# EAGLE design digimax-universal (EAGLE 4.13)
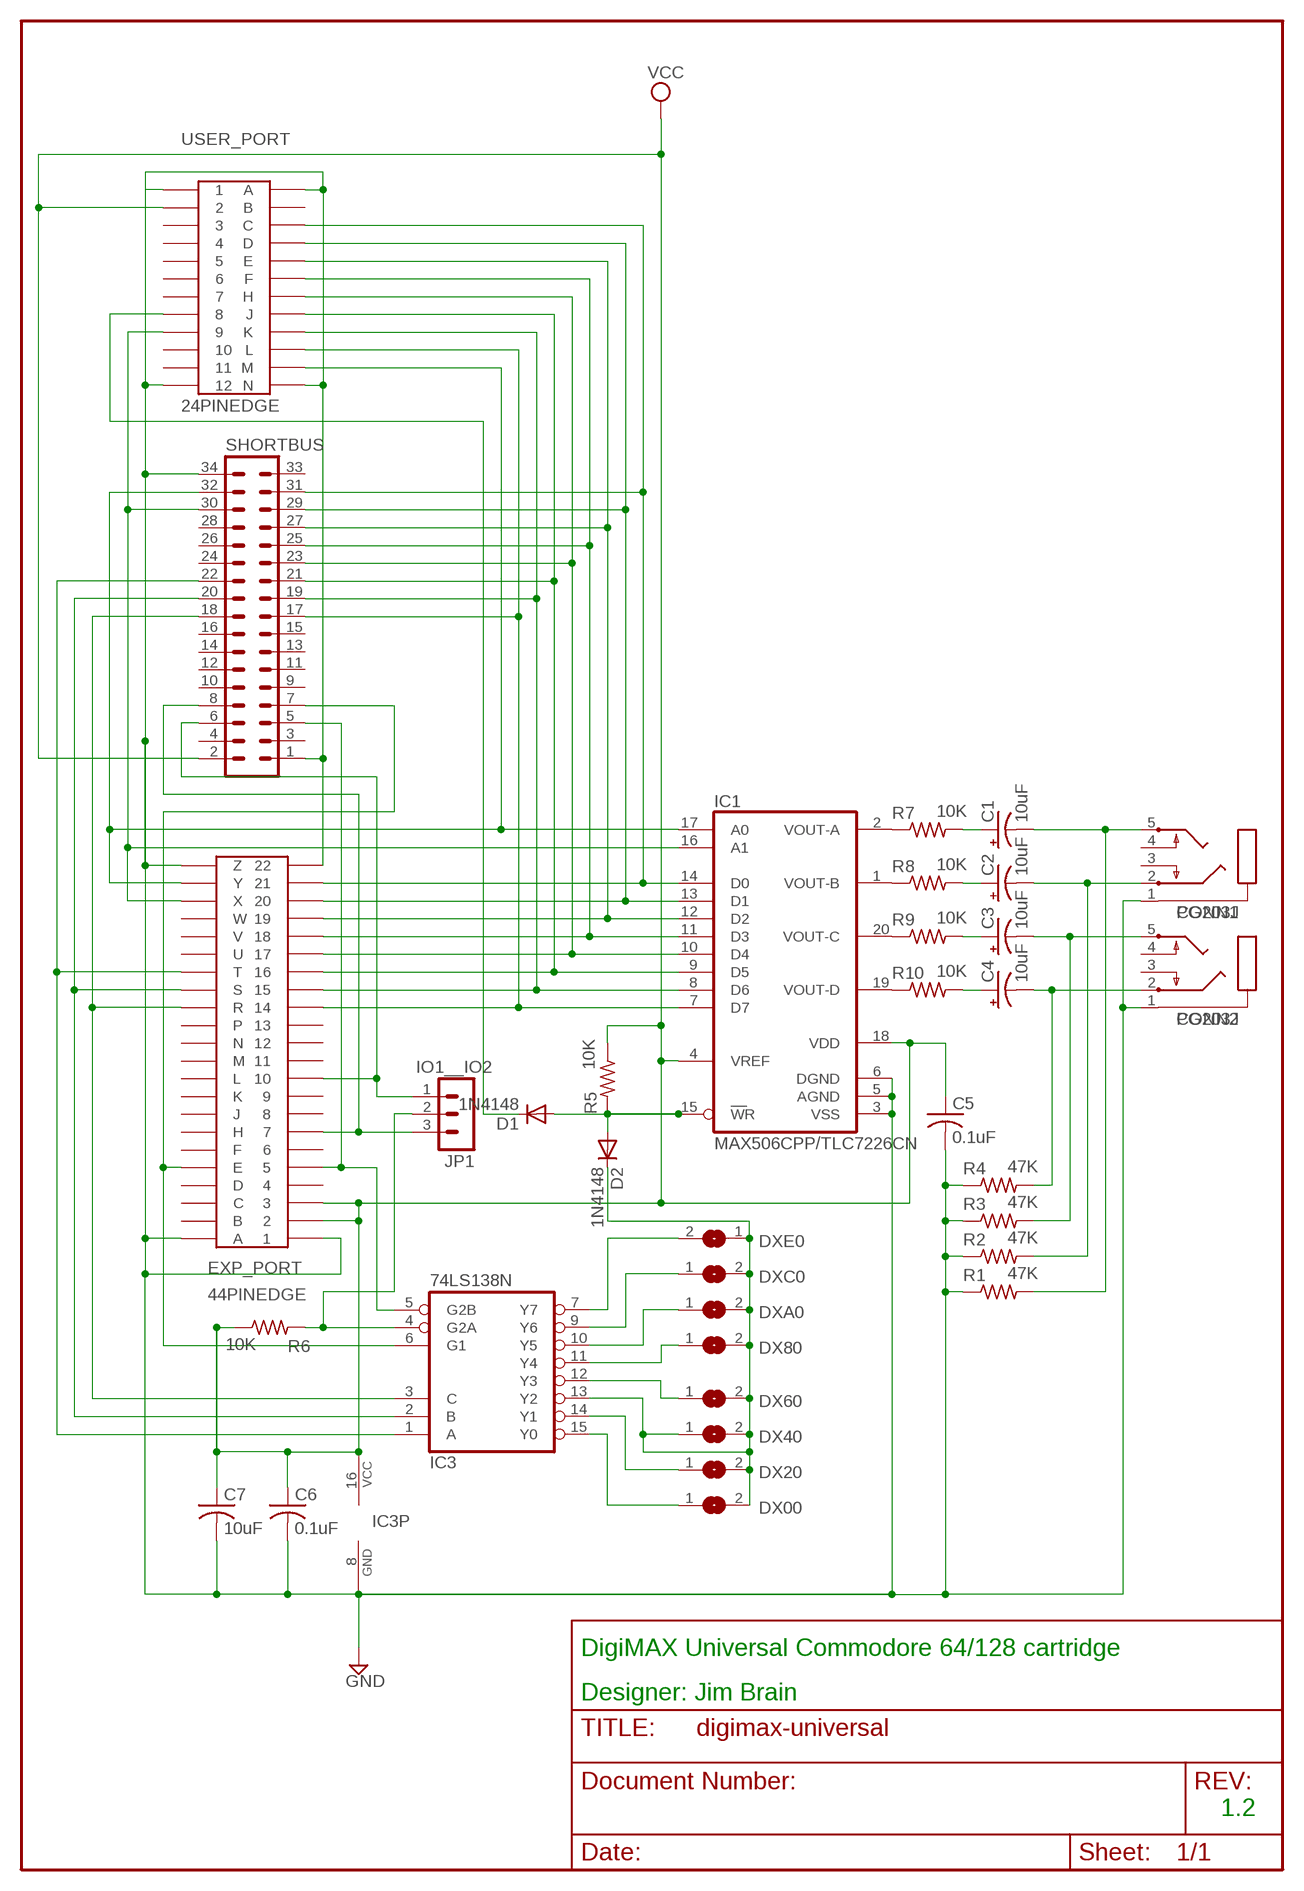
[diagram p0: schematic, sheet 1]

## Parts
C1  10uF  CPOL-USE2-5  [E2-5]
C2  10uF  CPOL-USE2-5  [E2-5]
C3  10uF  CPOL-USE2-5  [E2-5]
C4  10uF  CPOL-USE2-5  [E2-5]
C5  0.1uF  C-US025-024X044  [C025-024X044]
C6  0.1uF  C-US025-024X044  [C025-024X044]
C7  10uF  C-US025-025X050  [C025-025X050]
CONN1  PG203J  [PG203J]
CONN2  PG203J  [PG203J]
D1  1N4148  DIODE-D-2.5  [D-2.5]
D2  1N4148  DIODE-D-2.5  [D-2.5]
DX00  SJ  [SJ]
DX20  SJ  [SJ]
DX40  SJ  [SJ]
DX60  SJ  [SJ]
DX80  SJ  [SJ]
DXA0  SJ  [SJ]
DXC0  SJ  [SJ]
DXE0  SJ  [SJ]
EXP_PORT  44PINEDGE  [44PINEDGE]
IC1  MAX506CPP/TLC7226CN  MAX506CPP  [DIL20]
IC3  74LS138N  [DIL16]
JP1  IO1__IO2  MA03-1  [MA03-1]
R1  47K  R-US_0207/2V  [0207/2V]
R2  47K  R-US_0207/2V  [0207/2V]
R3  47K  R-US_0207/2V  [0207/2V]
R4  47K  R-US_0207/2V  [0207/2V]
R5  10K  R-US_0204/7  [0204/7]
R6  10K  R-US_0207/2V  [0207/2V]
R7  10K  R-US_0207/2V  [0207/2V]
R8  10K  R-US_0207/2V  [0207/2V]
R9  10K  R-US_0207/2V  [0207/2V]
R10  10K  R-US_0207/2V  [0207/2V]
SHORTBUS  MA17-2  [MA17-2]
USER_PORT  24PINEDGE  [24PINEDGE]

## Nets
GND: C5.2 C6.2 C7.2 CONN1.1 CONN2.1 EXP_PORT.1 EXP_PORT.22 EXP_PORT.A EXP_PORT.Z IC1.3(VSS) IC1.5(AGND) IC1.6(DGND) IC3.8(GND) R1.1 R2.1 R3.1 R4.1 SHORTBUS.1 SHORTBUS.34 USER_PORT.1 USER_PORT.12 USER_PORT.A USER_PORT.N
N$1: EXP_PORT.21 IC1.14(D0) SHORTBUS.31 USER_PORT.C
N$2: EXP_PORT.20 IC1.13(D1) SHORTBUS.29 USER_PORT.D
N$3: EXP_PORT.19 IC1.12(D2) SHORTBUS.27 USER_PORT.E
N$4: EXP_PORT.18 IC1.11(D3) SHORTBUS.25 USER_PORT.F
N$5: EXP_PORT.17 IC1.10(D4) SHORTBUS.23 USER_PORT.H
N$6: EXP_PORT.16 IC1.9(D5) SHORTBUS.21 USER_PORT.J
N$7: EXP_PORT.15 IC1.8(D6) SHORTBUS.19 USER_PORT.K
N$8: EXP_PORT.14 IC1.7(D7) SHORTBUS.17 USER_PORT.L
N$9: EXP_PORT.Y IC1.17(A0) SHORTBUS.32 USER_PORT.M
N$10: DXE0.2 IC3.7(Y7)
N$11: EXP_PORT.X IC1.16(A1) SHORTBUS.30 USER_PORT.9
N$12: EXP_PORT.10 JP1.1 SHORTBUS.6
N$13: D1.C USER_PORT.8
N$15: EXP_PORT.T IC3.1(A) SHORTBUS.22
N$16: IC3.4(G2A) JP1.2 R6.2
N$17: C1.+ R7.2
N$18: C2.+ R8.2
N$19: C3.+ R9.2
N$20: C4.+ R10.2
N$21: C4.- CONN2.2 R4.2
N$22: C3.- CONN2.5 R3.2
N$23: C2.- CONN1.2 R2.2
N$24: C1.- CONN1.5 R1.2
N$25: EXP_PORT.S IC3.2(B) SHORTBUS.20
N$26: EXP_PORT.R IC3.3(C) SHORTBUS.18
N$27: DXC0.1 IC3.9(Y6)
N$28: EXP_PORT.5 IC3.5(G2B) SHORTBUS.5
N$29: DXA0.1 IC3.10(Y5)
N$30: DX80.1 IC3.11(Y4)
N$31: DX60.1 IC3.12(Y3)
N$32: D2.C DX00.2 DX20.2 DX40.1 DX40.2 DX60.2 DX80.2 DXA0.2 DXC0.2 DXE0.1 IC3.13(Y2)
N$33: DX20.1 IC3.14(Y1)
N$34: DX00.1 IC3.15(Y0)
N$36: IC1.2(VOUT-A) R7.1
N$37: IC1.1(VOUT-B) R8.1
N$38: IC1.20(VOUT-C) R9.1
N$39: IC1.19(VOUT-D) R10.1
N$40: EXP_PORT.E IC3.6(G1) SHORTBUS.7
N$41: D1.A D2.A IC1.15(WR) R5.2
N$43: EXP_PORT.7 JP1.3 SHORTBUS.8
VCC: C5.1 C6.1 C7.1 EXP_PORT.2 EXP_PORT.3 IC1.4(VREF) IC1.18(VDD) IC3.16(VCC) R5.1 R6.1 SHORTBUS.2 USER_PORT.2
Unconnected: CONN1.3 CONN1.4 CONN2.3 CONN2.4 EXP_PORT.4 EXP_PORT.6 EXP_PORT.8 EXP_PORT.9 EXP_PORT.11 EXP_PORT.12 EXP_PORT.13 EXP_PORT.B EXP_PORT.C EXP_PORT.D EXP_PORT.F EXP_PORT.H EXP_PORT.J EXP_PORT.K EXP_PORT.L EXP_PORT.M EXP_PORT.N EXP_PORT.P EXP_PORT.U EXP_PORT.V EXP_PORT.W SHORTBUS.3 SHORTBUS.4 SHORTBUS.9 SHORTBUS.10 SHORTBUS.11 SHORTBUS.12 SHORTBUS.13 SHORTBUS.14 SHORTBUS.15 SHORTBUS.16 SHORTBUS.24 SHORTBUS.26 SHORTBUS.28 SHORTBUS.33 USER_PORT.3 USER_PORT.4 USER_PORT.5 USER_PORT.6 USER_PORT.7 USER_PORT.10 USER_PORT.11 USER_PORT.B

## Notes on the sheet
- DigiMAX Universal Commodore 64/128 cartridge
- Designer: Jim Brain
- 1.2

## Library data of the parts
C1-C4 = rcl:CPOL-US: POLARIZED CAPACITOR, American symbol
C5-C7 = rcl:C-US: CAPACITOR, American symbol
CONN1 CONN2 = con-hirschmann:PG203J: MIC/HEADPHONE JACK KS-S stereo microphone/headphone jack PG203JN (Schukat)
D1 D2 = diode:DIODE-: DIODE
DX00 DX20 DX40 DX60 DX80 DXA0 DXC0 DXE0 = jumper:SJ: SMD solder JUMPER
EXP_PORT = edge-100:44PINEDGE: 44 PIN EDGE CONNECTOR FOR PCB
IC1 = maxim:MAX506CPP: DIGITAL/ANALOG CONVERTER
IC3 = 74xx-us:74*138: 3-line to 8-line DECODER/DEMULTIPLEXER
JP1 = con-lstb:MA03-1: PIN HEADER
R1-R10 = rcl:R-US_: RESISTOR, American symbol
SHORTBUS = con-lstb:MA17-2: PIN HEADER
USER_PORT = edge-156:24PINEDGE

## Board
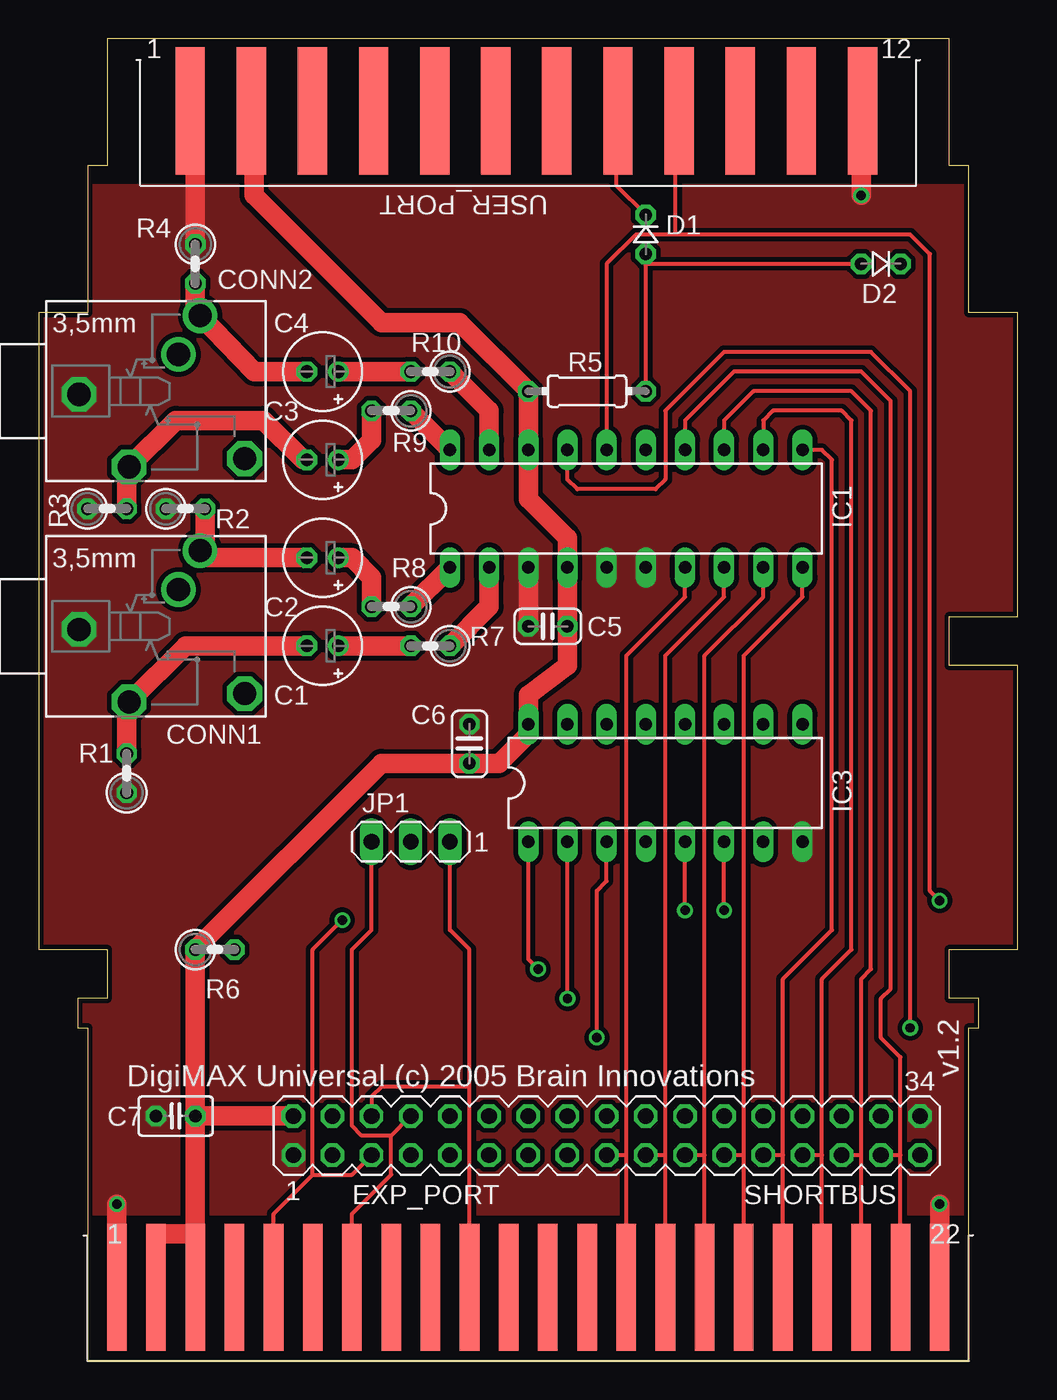
[diagram p1: board, top side]
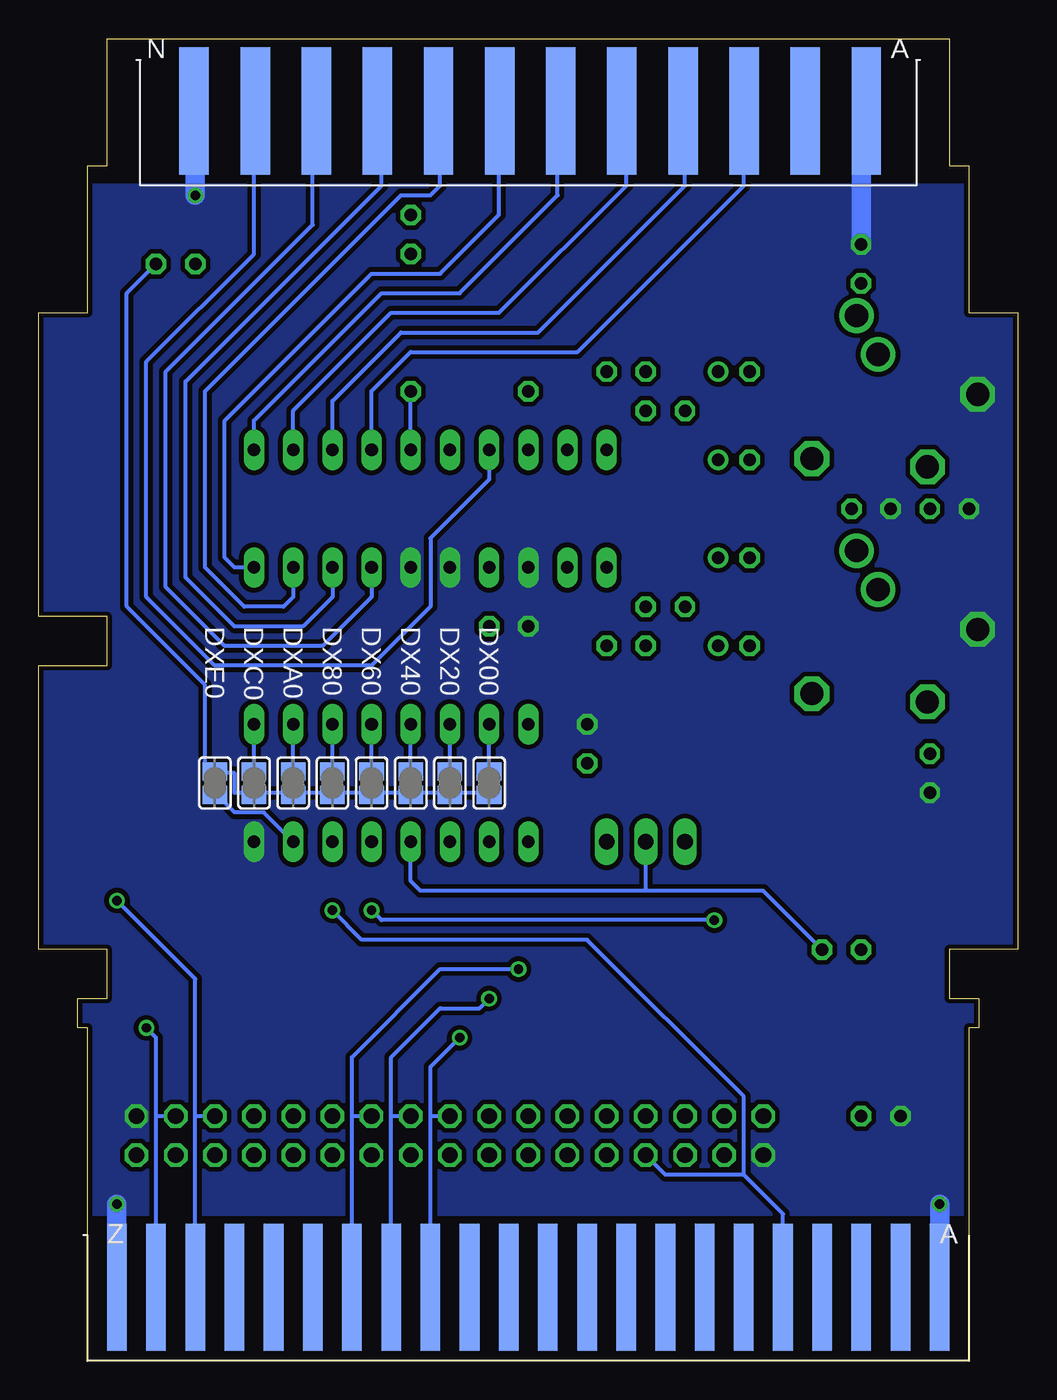
[diagram p2: board, bottom side, seen from below]

Size 63.5 x 85.72 mm. Coordinates in mm from the lower left corner, seen from the top.
Outline: 3.17,0 60.33,0 60.33,21.59 60.96,21.59 60.96,23.5 59.05,23.5 59.05,26.67 63.5,26.67 63.5,45.09 59.05,45.09 59.05,48.26 63.5,48.26 63.5,67.94 60.33,67.94 60.33,77.47 59.05,77.47 59.05,85.72 4.45,85.72 4.45,77.47 3.17,77.47 3.17,67.94 0,67.94 0,26.67 4.45,26.67 4.45,23.5 2.54,23.5 2.54,21.59 3.17,21.59 3.17,0
Copper layers (1*16): Top 0.035mm / dielectric 1.5mm / Bottom 0.035mm
Design rules "default": minimum track width 10mil, minimum drill 24mil, track to track 12mil, track to pad 12mil, pad to pad 12mil, via to via 12mil, smd to smd 12mil, copper to edge 12mil, drill to drill 8mil, minimum pad ring 10mil, minimum via ring 8mil, stop-mask expansion 4mil, vias tented up to drill 0mil, thermal gap 10mil

### Footprints (pad centres in the part's own frame; a part is rotated, then mirrored left to right if it is on the bottom)
E2-5 = drill 0.813 pad 1.27 round: + -1.016,0 | drill 0.813 pad 1.27 octagon: - 1.016,0
C025-024X044 = drill 0.813 octagon: 1 -1.27,0; 2 1.27,0
C025-025X050 = drill 0.813 octagon: 1 -1.27,0; 2 1.27,0
PG203J = drill 1.499 octagon: 1 -5.004,-0.203; 4 5.74,-4.369; 5 -1.753,-4.902 | drill 1.499 round: 2 2.845,4.902; 3 1.448,2.388
D-2.5 = drill 0.813 octagon: A 1.27,0; C -1.27,0
SJ = smd 1.168 x 1.6: 1 -0.762,0; 2 0.762,0
44PINEDGE = smd 1.27 x 8.255: 1 -24.765,-0.305; 2 -22.225,-0.305; 3 -19.685,-0.305; 4 -17.145,-0.305; 5 -14.605,-0.305; 6 -12.065,-0.305; 7 -9.525,-0.305; 8 -6.985,-0.305; 9 -4.445,-0.305; 10 -1.905,-0.305; 11 0.635,-0.305; 12 3.175,-0.305; 13 5.715,-0.305; 14 8.255,-0.305; 15 10.795,-0.305; 16 13.335,-0.305; 17 15.875,-0.305; 18 18.415,-0.305; 19 20.955,-0.305; 20 23.495,-0.305; 21 26.035,-0.305; 22 28.575,-0.305 | smd 1.27 x 8.255 bottom: A -24.765,-0.305; B -22.225,-0.305; C -19.685,-0.305; D -17.145,-0.305; E -14.605,-0.305; F -12.065,-0.305; H -9.525,-0.305; J -6.985,-0.305; K -4.445,-0.305; L -1.905,-0.305; M 0.635,-0.305; N 3.175,-0.305; P 5.715,-0.305; R 8.255,-0.305; S 10.795,-0.305; T 13.335,-0.305; U 15.875,-0.305; V 18.415,-0.305; W 20.955,-0.305; X 23.495,-0.305; Y 26.035,-0.305; Z 28.575,-0.305
DIL20 = drill 0.813 long: 1 -11.43,-3.81; 2 -8.89,-3.81; 3 -6.35,-3.81; 4 -3.81,-3.81; 5 -1.27,-3.81; 6 1.27,-3.81; 7 3.81,-3.81; 8 6.35,-3.81; 9 8.89,-3.81; 10 11.43,-3.81; 11 11.43,3.81; 12 8.89,3.81; 13 6.35,3.81; 14 3.81,3.81; 15 1.27,3.81; 16 -1.27,3.81; 17 -3.81,3.81; 18 -6.35,3.81; 19 -8.89,3.81; 20 -11.43,3.81
DIL16 = drill 0.813 long: 1 -8.89,-3.81; 2 -6.35,-3.81; 3 -3.81,-3.81; 4 -1.27,-3.81; 5 1.27,-3.81; 6 3.81,-3.81; 7 6.35,-3.81; 8 8.89,-3.81; 9 8.89,3.81; 10 6.35,3.81; 11 3.81,3.81; 12 1.27,3.81; 13 -1.27,3.81; 14 -3.81,3.81; 15 -6.35,3.81; 16 -8.89,3.81
MA03-1 = drill 1.016 long: 1 -2.54,0; 2 0,0; 3 2.54,0
0207/2V = drill 0.813 octagon: 1 -1.27,0; 2 1.27,0
0204/7 = drill 0.813 octagon: 1 -3.81,0; 2 3.81,0
MA17-2 = drill 1.016 octagon: 1 -20.32,-1.27; 2 -20.32,1.27; 3 -17.78,-1.27; 4 -17.78,1.27; 5 -15.24,-1.27; 6 -15.24,1.27; 7 -12.7,-1.27; 8 -12.7,1.27; 9 -10.16,-1.27; 10 -10.16,1.27; 11 -7.62,-1.27; 12 -7.62,1.27; 13 -5.08,-1.27; 14 -5.08,1.27; 15 -2.54,-1.27; 16 -2.54,1.27; 17 0,-1.27; 18 0,1.27; 19 2.54,-1.27; 20 2.54,1.27; 21 5.08,-1.27; 22 5.08,1.27; 23 7.62,-1.27; 24 7.62,1.27; 25 10.16,-1.27; 26 10.16,1.27; 27 12.7,-1.27; 28 12.7,1.27; 29 15.24,-1.27; 30 15.24,1.27; 31 17.78,-1.27; 32 17.78,1.27; 33 20.32,-1.27; 34 20.32,1.27
24PINEDGE = smd 1.905 x 8.255: 1 -21.285,-0.254; 2 -17.323,-0.254; 3 -13.36,-0.254; 4 -9.398,-0.254; 5 -5.436,-0.254; 6 -1.473,-0.254; 7 2.489,-0.254; 8 6.452,-0.254; 9 10.414,-0.254; 10 14.376,-0.254; 11 18.339,-0.254; 12 22.301,-0.254 | smd 1.905 x 8.255 bottom: A -21.285,-0.254; B -17.323,-0.254; C -13.36,-0.254; D -9.398,-0.254; E -5.436,-0.254; F -1.473,-0.254; H 2.489,-0.254; J 6.452,-0.254; K 10.414,-0.254; L 14.376,-0.254; M 18.339,-0.254; N 22.301,-0.254

### Placement (x,y rotation side)
C1  18.41,46.35 180 top
C2  18.41,52.07 180 top
C3  18.41,58.42 180 top
C4  18.41,64.14 180 top
C5  33.02,47.62 180 top
C6  27.94,40.01 90 top
C7  8.89,15.88 180 top
CONN1  7.62,47.62 0 top
CONN2  7.62,62.87 0 top
D1  39.37,73.03 270 top
D2  54.61,71.12 180 top
DX00  34.29,37.47 270 bottom
DX20  36.83,37.47 270 bottom
DX40  39.37,37.47 270 bottom
DX60  41.91,37.47 270 bottom
DX80  44.45,37.47 270 bottom
DXA0  46.99,37.47 270 bottom
DXC0  49.53,37.47 270 bottom
DXE0  52.07,37.47 270 bottom
EXP_PORT  29.84,5.08 0 top
IC1  38.1,55.24 0 top
IC3  40.64,37.47 0 top
JP1  24.13,33.66 180 top
R1  5.71,38.1 90 top
R2  9.53,55.24 0 top
R3  4.45,55.24 0 top
R4  10.16,71.12 270 top
R5  35.56,62.87 0 top
R6  11.43,26.67 0 top
R7  25.4,46.35 180 top
R8  22.86,48.9 180 top
R9  22.86,61.59 180 top
R10  25.4,64.14 180 top
SHORTBUS  36.83,14.61 0 top
USER_PORT  31.11,81.28 0 top

### Tracks (layer width: path | path; a pad name or v marks a point on that pad's centre or on a via)
GND  (via drill 0.61)
  Top 1.27: C5.2 IC1.3 | EXP_PORT.1 v5.08,10.16 | R4.1 10.16,78.11 USER_PORT.A | 58.42,4.45 EXP_PORT.Z v58.42,10.16 | USER_PORT.12 53.34,78.11 v53.34,75.56
  Bottom 1.27: R4.1 10.16,78.11 USER_PORT.A | USER_PORT.12 53.34,78.11 v53.34,75.56 | EXP_PORT.Z v58.42,10.16 EXP_PORT.Z | v5.08,10.16 EXP_PORT.1 v5.08,10.16
  pour Bottom (no thermals): 3.17,76.2 60.33,76.2 60.33,67.94 63.5,67.94 63.5,48.26 59.05,48.26 59.05,45.09 63.5,45.09 63.5,26.67 59.05,26.67 59.05,23.5 60.96,23.5 60.96,21.59 60.33,21.59 60.33,9.53 3.17,9.53 3.17,21.59 2.54,21.59 2.54,23.5 4.45,23.5 4.45,26.67 0,26.67 0,67.94 3.17,67.94
  pour Top (no thermals): 3.17,76.2 60.33,76.2 60.33,67.94 63.5,67.94 63.5,48.26 59.05,48.26 59.05,45.09 63.5,45.09 63.5,26.67 59.05,26.67 59.05,23.5 60.96,23.5 60.96,21.59 60.33,21.59 60.33,9.53 3.17,9.53 3.17,21.59 2.54,21.59 2.54,23.5 4.45,23.5 4.45,26.67 0,26.67 0,67.94 3.17,67.94
N$1
  Top 0.254: EXP_PORT.21 55.88,13.34 | 55.88,13.34 55.88,19.68 54.61,20.95 54.61,23.5 55.24,24.13 55.24,62.23 53.34,64.14 45.09,64.14 41.91,60.96 IC1.14 | 55.88,13.34 SHORTBUS.31
  Bottom 0.254: USER_PORT.C 17.78,77.47 17.78,76.2 28.57,65.41 39.37,65.41 41.91,62.87 IC1.14
N$2
  Top 0.254: EXP_PORT.20 53.34,13.34 | 53.34,13.34 53.34,24.77 53.98,25.4 53.98,61.59 52.7,62.87 46.35,62.87 44.45,60.96 IC1.13 | 53.34,13.34 SHORTBUS.29
  Bottom 0.254: USER_PORT.D 21.59,77.47 21.59,76.2 31.11,66.67 40.01,66.67 44.45,62.23 IC1.13
N$3
  Top 0.254: EXP_PORT.19 50.8,13.34 | 50.8,13.34 50.8,24.77 52.7,26.67 52.7,60.96 52.07,61.59 47.62,61.59 46.99,60.96 IC1.12 | 50.8,13.34 SHORTBUS.27
  Bottom 0.254: USER_PORT.E 25.4,77.47 25.4,76.2 33.66,67.94 40.64,67.94 46.99,61.59 IC1.12
N$4
  Top 0.254: EXP_PORT.18 48.26,13.34 | 48.26,13.34 48.26,24.77 51.44,27.94 51.44,58.42 50.8,59.05 IC1.11 | 48.26,13.34 SHORTBUS.25
  Bottom 0.254: USER_PORT.F 29.84,77.47 29.84,75.56 36.2,69.22 41.27,69.22 49.53,60.96 IC1.11
N$5
  Top 0.254: EXP_PORT.17 45.72,13.34 | 45.72,13.34 45.72,45.72 49.53,49.53 IC1.10 | 45.72,13.34 SHORTBUS.23
  Bottom 0.254: USER_PORT.H 33.66,77.47 33.66,74.3 37.47,70.48 41.91,70.48 51.44,60.96 51.44,52.07 50.8,51.44 IC1.10
N$6
  Top 0.254: EXP_PORT.16 43.18,13.34 | 43.18,13.34 43.18,45.72 46.99,49.53 IC1.9 | 43.18,13.34 SHORTBUS.21
  Bottom 0.254: USER_PORT.J 37.47,77.47 37.47,76.2 38.1,75.56 40.01,75.56 52.7,62.87 52.7,51.44 50.16,48.9 47.62,48.9 46.99,49.53 IC1.9
N$7
  Top 0.254: EXP_PORT.15 40.64,13.34 | 40.64,13.34 40.64,45.72 44.45,49.53 IC1.8 | 40.64,13.34 SHORTBUS.19
  Bottom 0.254: USER_PORT.K 41.27,77.47 41.27,76.2 53.98,63.5 53.98,50.8 50.8,47.62 46.35,47.62 44.45,49.53 IC1.8
N$8
  Top 0.254: EXP_PORT.14 38.1,13.34 | 38.1,13.34 38.1,45.72 41.91,49.53 IC1.7 | 38.1,13.34 SHORTBUS.17
  Bottom 0.254: USER_PORT.L 45.72,77.47 45.72,73.66 55.24,64.14 55.24,50.16 51.44,46.35 45.09,46.35 41.91,49.53 IC1.7
N$9  (via drill 0.61)
  Top 0.254: v56.52,21.59 56.52,62.87 53.98,65.41 44.45,65.41 40.64,61.59 40.64,57.15 40.01,56.52 34.92,56.52 34.29,57.15 IC1.17
  Bottom 0.254: USER_PORT.M 49.53,77.47 49.53,71.75 56.52,64.77 56.52,49.53 52.07,45.09 41.91,45.09 38.1,48.9 38.1,53.34 34.29,57.15 IC1.17 | EXP_PORT.Y 55.88,15.88 | 55.88,15.88 55.88,20.95 v56.52,21.59 | 55.88,15.88 SHORTBUS.32
N$10
  Bottom 0.254: DXE0.2 51.44,36.2 50.8,35.56 48.9,35.56 IC3.7
N$11  (via drill 0.61)
  Top 0.254: 41.27,73.03 38.73,73.03 36.83,71.12 IC1.16 | v58.42,29.84 57.78,30.48 57.78,71.75 56.52,73.03 41.27,73.03 | 41.27,73.03 41.27,77.47 USER_PORT.9
  Bottom 0.254: EXP_PORT.X 53.34,15.88 | 53.34,15.88 53.34,24.77 v58.42,29.84 | 53.34,15.88 SHORTBUS.30
N$12
  Top 0.254: JP1.1 26.67,27.94 27.94,26.67 27.94,17.78 | EXP_PORT.10 27.94,17.78 | SHORTBUS.6 21.59,17.14 22.23,17.78 27.94,17.78
N$13
  Top 0.254: D1.C 37.47,76.2 37.47,77.47 USER_PORT.8
N$15  (via drill 0.61)
  Top 0.254: v32.38,25.4 31.75,26.04 IC3.1
  Bottom 0.254: v32.38,25.4 37.47,25.4 43.18,19.68 43.18,15.88 | EXP_PORT.T 43.18,15.88 | 43.18,15.88 SHORTBUS.22
N$16
  Bottom 0.254: R6.2 16.51,30.48 24.13,30.48 | IC3.4 39.37,31.11 38.73,30.48 24.13,30.48 | 24.13,30.48 JP1.2
N$17
  Top 1.27: C1.+ R7.2
N$18
  Top 1.27: C2.+ 20.32,52.07 21.59,50.8 R8.2
N$19
  Top 1.27: C3.+ 20.32,58.42 21.59,59.69 R9.2
N$20
  Top 1.27: C4.+ R10.2
N$21
  Top 1.27: R4.2 10.16,67.94 CONN2.2 13.97,64.14 C4.-
N$22
  Top 1.27: R3.2 5.71,57.15 CONN2.5 8.89,60.96 14.61,60.96 17.14,58.42 C3.-
N$23
  Top 1.27: 10.79,52.07 C2.- | CONN1.2 10.79,52.07 | 10.79,52.07 R2.2
N$24
  Top 1.27: C1.- 9.53,46.35 CONN1.5 5.71,41.91 R1.2
N$25  (via drill 0.61)
  Top 0.254: v34.29,23.5 IC3.2
  Bottom 0.254: v34.29,23.5 34.92,22.86 37.47,22.86 40.64,19.68 40.64,15.88 | EXP_PORT.S 40.64,15.88 | 40.64,15.88 SHORTBUS.20
N$26  (via drill 0.61)
  Top 0.254: v36.2,20.95 36.2,30.48 36.83,31.11 IC3.3
  Bottom 0.254: EXP_PORT.R 38.1,15.88 | 38.1,15.88 38.1,19.05 v36.2,20.95 | 38.1,15.88 SHORTBUS.18
N$27
  Bottom 0.254: DXC0.1 IC3.9
N$28  (via drill 0.61)
  Top 0.254: v19.68,28.57 17.78,26.67 17.78,12.06 | v41.91,29.21 IC3.5 | EXP_PORT.5 15.24,9.53 17.78,12.06 | 17.78,12.06 20.32,12.06 SHORTBUS.5
  Bottom 0.254: v19.68,28.57 41.27,28.57 v41.91,29.21
N$29
  Bottom 0.254: DXA0.1 IC3.10
N$30
  Bottom 0.254: DX80.1 IC3.11
N$31
  Bottom 0.254: DX60.1 IC3.12
N$32
  Bottom 0.254: IC3.13 DX40.1 DX40.2 | DX00.2 34.92,36.83 36.2,36.83 DX20.2 37.47,36.83 38.73,36.83 DX40.2 | DX40.2 40.01,36.83 41.27,36.83 DX60.2 42.55,36.83 43.81,36.83 DX80.2 45.09,36.83 46.35,36.83 DXA0.2 47.62,36.83 48.9,36.83 DXC0.2 50.16,36.83 50.8,36.83 50.8,38.1 51.44,38.1 DXE0.1 | D2.C 57.78,69.22 57.78,48.9 52.7,43.81 52.7,38.73 DXE0.1 | DXE0.1 52.07,38.1
N$33
  Bottom 0.254: DX20.1 IC3.14
N$34
  Bottom 0.254: DX00.1 IC3.15
N$36
  Top 1.27: IC1.2 29.21,48.9 R7.1
N$37
  Top 1.27: R8.1 IC1.1
N$38
  Top 1.27: R9.1 IC1.20
N$39
  Top 1.27: IC1.19 29.21,61.59 R10.1
N$40  (via drill 0.61)
  Top 0.254: v44.45,29.21 IC3.6
  Bottom 0.254: v44.45,29.21 42.55,27.3 27.94,27.3 17.78,17.14 17.78,12.06 | EXP_PORT.E 15.24,9.53 17.78,12.06 | 17.78,12.06 22.86,12.06 SHORTBUS.7
N$41
  Top 0.254: 39.37,71.12 D2.A | R5.2 39.37,71.12 | 39.37,71.12 D1.A
  Bottom 0.254: IC1.15 R5.2
N$43
  Top 0.254: JP1.3 21.59,27.94 20.32,26.67 20.32,15.24 20.95,14.61 22.86,14.61 | EXP_PORT.7 20.32,9.53 22.86,12.06 22.86,14.61 | 22.86,14.61 SHORTBUS.8
VCC
  Top 1.27: 10.16,8.26 7.62,8.26 EXP_PORT.2 | USER_PORT.2 13.97,78.11 13.97,75.56 22.23,67.31 27.3,67.31 R5.1 IC1.18 31.75,55.88 34.29,53.34 IC1.4 C5.1 34.29,45.09 31.75,43.18 IC3.16 31.75,40.64 29.84,38.73 C6.1 22.23,38.73 R6.1 C7.1 | 10.16,8.26 C7.1 | 10.16,8.26 EXP_PORT.3 | C7.1 SHORTBUS.2

### Text on the board
tPlace: DigiMAX Universal (c) 2005 Brain Innovations | v1.2